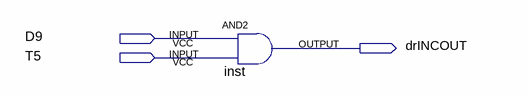
[diagram p0: schematic sheet]
// Quartus schematic drINC.bdf as structural Verilog: 1 symbols, 3 pins
module drINC (
  input  D9,
  input  T5,
  output drINCOUT
);

  and inst (drINCOUT, D9, T5);
endmodule
